# Altium schematic sheet 2_02 Peripherals.SchDoc.schdoc
size 858 x 289 mm; Name: A_Customize; Symbol: A_Customize; Device: A_Customize; @Project Name: 02 Peripherals.SchDoc; REV: 1.0; Date: 2024-05-14; Sheet: 1/1; Draw By: TheConquerK; Company: NEU-REAL-LAB; Convert to PCB: yes; Add into BOM: yes
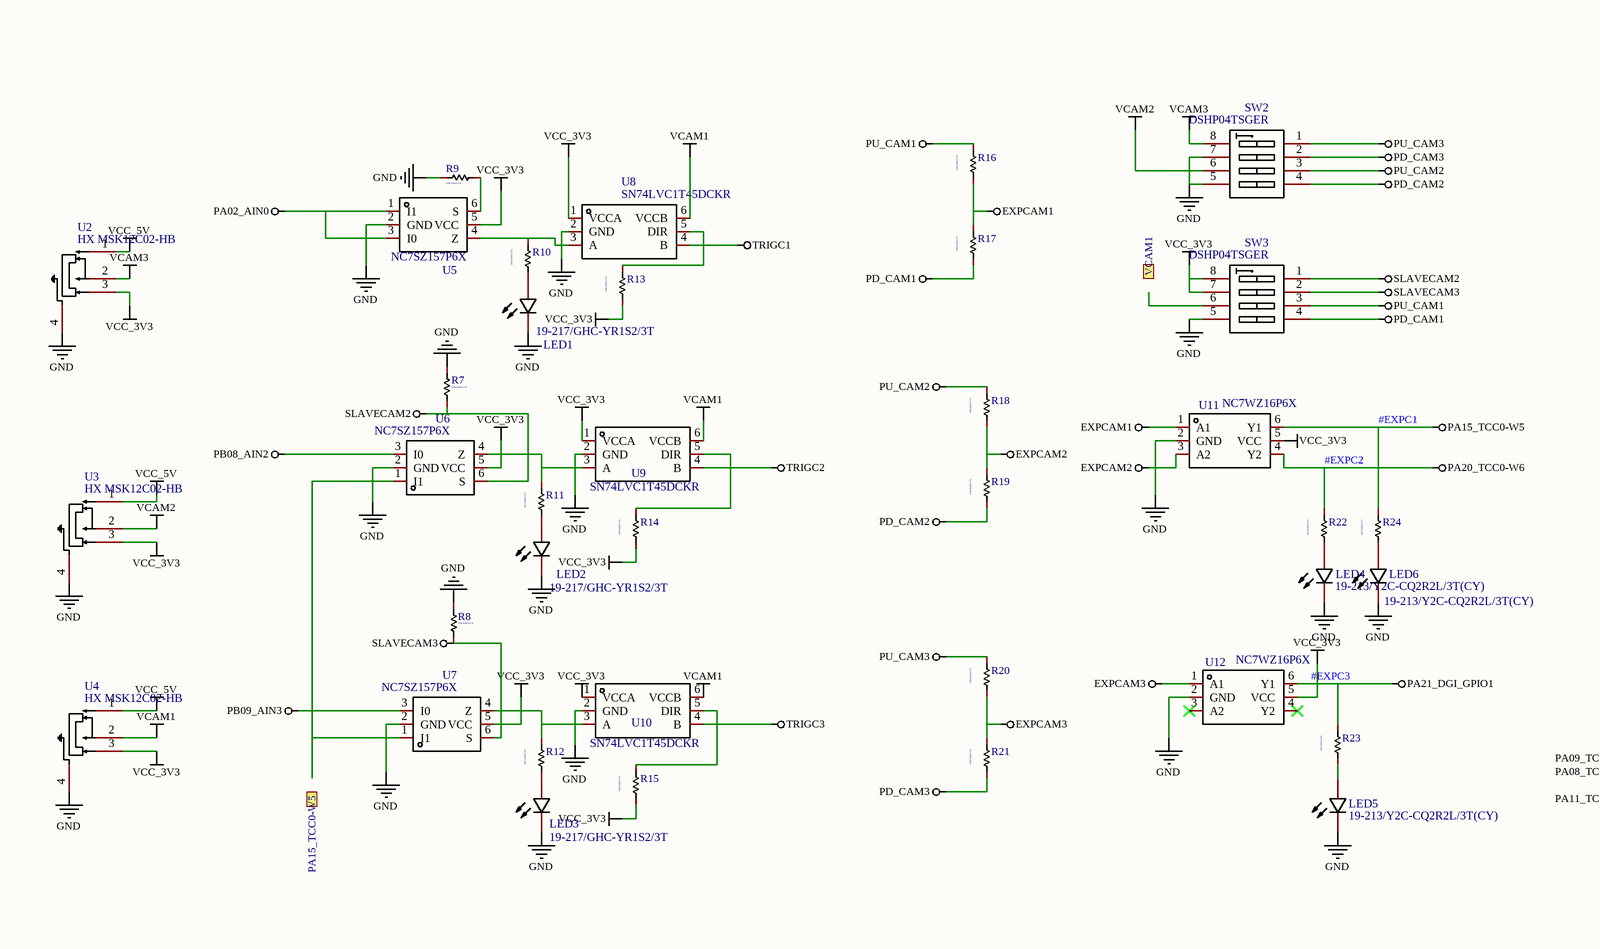
[diagram p0: 2_02 Peripherals.SchDoc.schdoc, left]
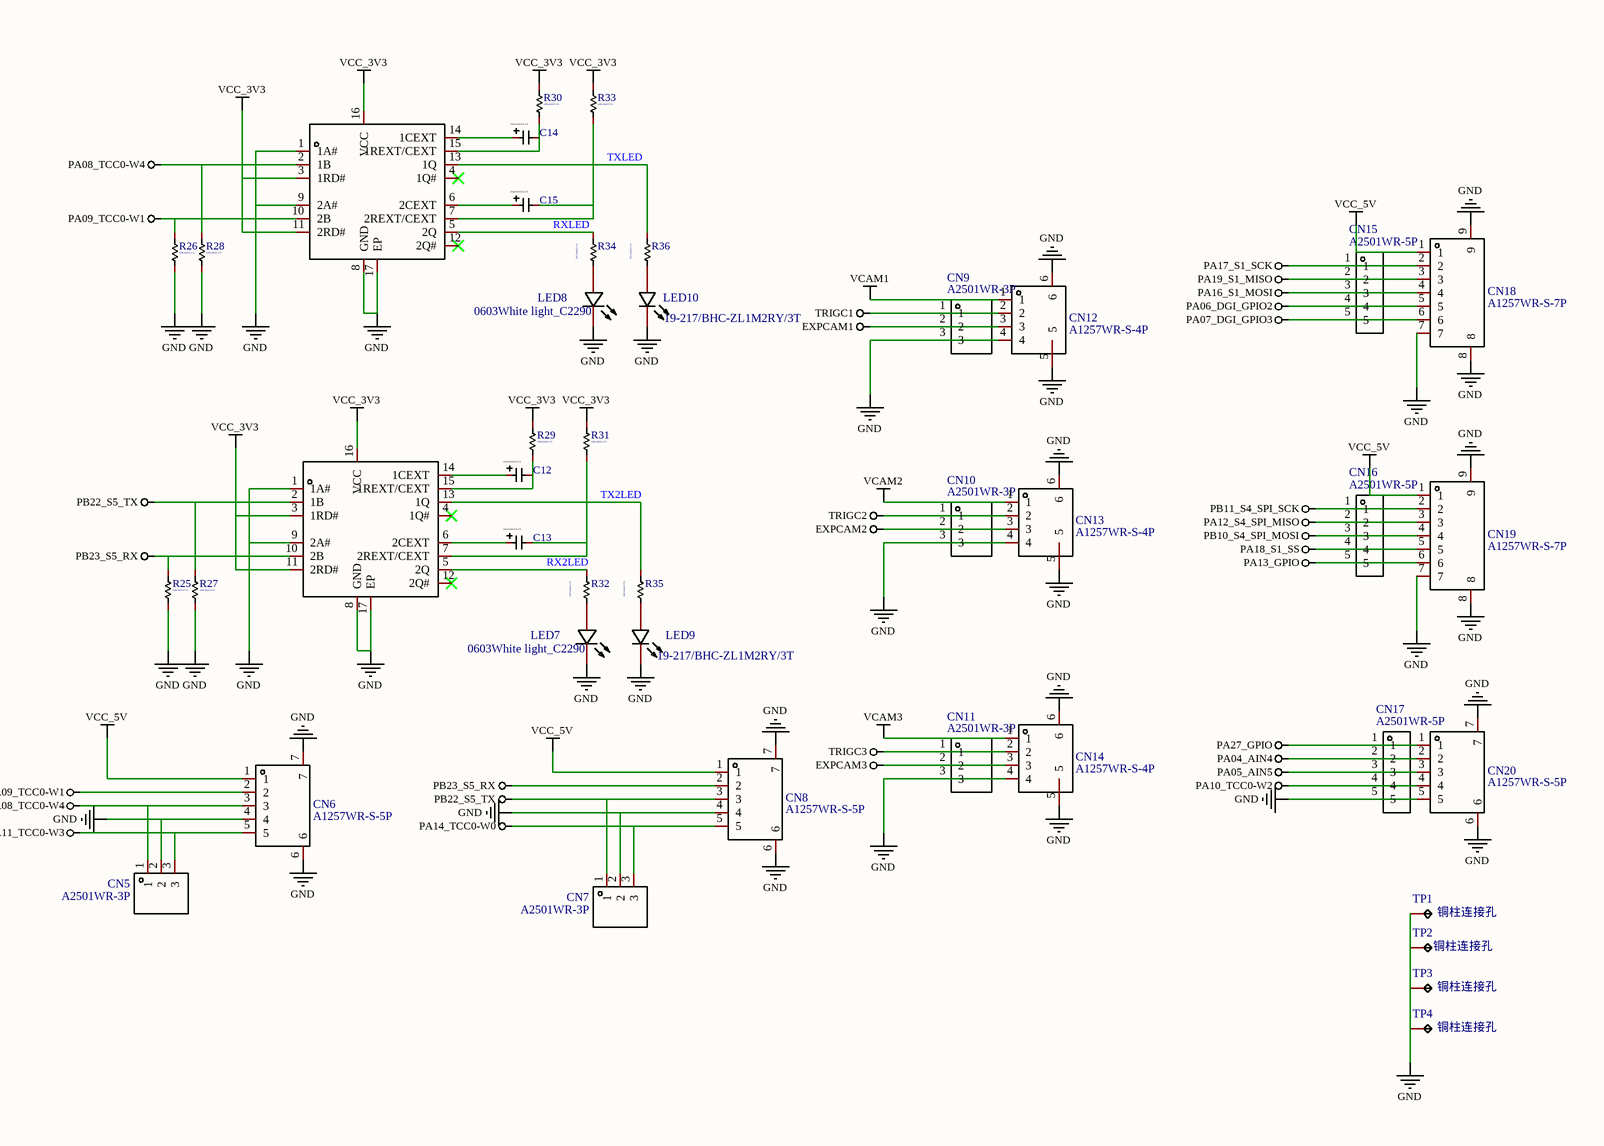
[diagram p1: 2_02 Peripherals.SchDoc.schdoc, right]

## Parts
C12  2.2u  [C0603]  (value not drawn)
C13  2.2u  [C0603]  (value not drawn)
C14  2.2u  [C0603]  (value not drawn)
C15  2.2u  [C0603]  (value not drawn)
CN5  A2501WR-3P  [CONN-TH_A2501WR-3P]
CN6  A1257WR-S-5P  [CONN-SMD_A1257WR-S-5P]
CN7  A2501WR-3P  [CONN-TH_A2501WR-3P]
CN8  A1257WR-S-5P  [CONN-SMD_A1257WR-S-5P]
CN9  A2501WR-3P  [CONN-TH_A2501WR-3P]
CN10  A2501WR-3P  [CONN-TH_A2501WR-3P]
CN11  A2501WR-3P  [CONN-TH_A2501WR-3P]
CN12  A1257WR-S-4P  [CONN-SMD_A1257WR-S-4P]
CN13  A1257WR-S-4P  [CONN-SMD_A1257WR-S-4P]
CN14  A1257WR-S-4P  [CONN-SMD_A1257WR-S-4P]
CN15  A2501WR-5P  [CONN-TH_A2501WR-5P]
CN16  A2501WR-5P  [CONN-TH_A2501WR-5P]
CN17  A2501WR-5P  [CONN-TH_A2501WR-5P]
CN18  A1257WR-S-7P  [CONN-SMD_A1257WR-S-7P]
CN19  A1257WR-S-7P  [CONN-SMD_A1257WR-S-7P]
CN20  A1257WR-S-5P  [CONN-SMD_A1257WR-S-5P]
LED1  19-217/GHC-YR1S2/3T  [LED0603-RD]
LED2  19-217/GHC-YR1S2/3T  [LED0603-RD]
LED3  19-217/GHC-YR1S2/3T  [LED0603-RD]
LED4  19-213/Y2C-CQ2R2L/3T(CY)  [LED0603-RD-YELLOW]
LED5  19-213/Y2C-CQ2R2L/3T(CY)  [LED0603-RD-YELLOW]
LED6  19-213/Y2C-CQ2R2L/3T(CY)  [LED0603-RD-YELLOW]
LED7  0603White light_C2290  [LED0603-R-RD_WHITE]
LED8  0603White light_C2290  [LED0603-R-RD_WHITE]
LED9  19-217/BHC-ZL1M2RY/3T  [LED0603-FD_BLUE]
LED10  19-217/BHC-ZL1M2RY/3T  [LED0603-FD_BLUE]
R7  10K/0402/1%  [R0402]
R8  10K/0402/1%  [R0402]
R9  10K/0402/1%  [R0402]
R10  2K2/0402/1%  [R0402]
R11  2K2/0402/1%  [R0402]
R12  2K2/0402/1%  [R0402]
R13  10K/0402/1%  [R0402]
R14  10K/0402/1%  [R0402]
R15  10K/0402/1%  [R0402]
R16  10K/0402/1%  [R0402]
R17  10K/0402/1%  [R0402]
R18  10K/0402/1%  [R0402]
R19  10K/0402/1%  [R0402]
R20  10K/0402/1%  [R0402]
R21  10K/0402/1%  [R0402]
R22  2K2/0402/1%  [R0402]
R23  2K2/0402/1%  [R0402]
R24  2K2/0402/1%  [R0402]
R25  10K/0402/1%  [R0402]
R26  10K/0402/1%  [R0402]
R27  10K/0402/1%  [R0402]
R28  10K/0402/1%  [R0402]
R29  10K/0402/1%  [R0402]
R30  10K/0402/1%  [R0402]
R31  10K/0402/1%  [R0402]
R32  2K2/0402/1%  [R0402]
R33  10K/0402/1%  [R0402]
R34  2K2/0402/1%  [R0402]
R35  2K2/0402/1%  [R0402]
R36  2K2/0402/1%  [R0402]
SW2  DSHP04TSGER  [SW-SMD_8P-L6.7-W5.4-P1.27-LS8.4]
SW3  DSHP04TSGER  [SW-SMD_8P-L6.7-W5.4-P1.27-LS8.4]
TP1  铜柱连接孔  [3MM铜柱孔]
TP2  铜柱连接孔  [3MM铜柱孔]
TP3  铜柱连接孔  [3MM铜柱孔]
TP4  铜柱连接孔  [3MM铜柱孔]
U2  HX MSK12C02-HB  [SW-SMD_MSK12C02-HB]
U3  HX MSK12C02-HB  [SW-SMD_MSK12C02-HB]
U4  HX MSK12C02-HB  [SW-SMD_MSK12C02-HB]
U5  NC7SZ157P6X  [SC-70-6_L2.0-W1.3-P0.65-LS2.1-BR]
U6  NC7SZ157P6X  [SC-70-6_L2.0-W1.3-P0.65-LS2.1-BR]
U7  NC7SZ157P6X  [SC-70-6_L2.0-W1.3-P0.65-LS2.1-BR]
U8  SN74LVC1T45DCKR  [SC-70-6_L2.2-W1.3-P0.65-LS2.2-BR]
U9  SN74LVC1T45DCKR  [SC-70-6_L2.2-W1.3-P0.65-LS2.2-BR]
U10  SN74LVC1T45DCKR  [SC-70-6_L2.2-W1.3-P0.65-LS2.2-BR]
U11  NC7WZ16P6X  [SC-70-6_L2.2-W1.3-P0.65-LS2.1-BR]
U12  NC7WZ16P6X  [SC-70-6_L2.2-W1.3-P0.65-LS2.1-BR]
U13  74AHC123ABQ,115  [74AHC123ABQ,115]  (value not drawn)
U14  74AHC123ABQ,115  [74AHC123ABQ,115]  (value not drawn)

## Ports
PA15_TCC0-W5 (out), VCAM1 (out)

## Nets
#EXPC1: R24.2 U11.6(Y1)  [also labelled PA15_TCC0-W5]
#EXPC2: R22.2 U11.4(Y2)  [also labelled PA20_TCC0-W6]
#EXPC3: R23.2 U12.6(Y1)  [also labelled PA21_DGI_GPIO1]
EXPCAM1: CN9.2 CN12.3 R16.1 R17.2 U11.1(A1)
EXPCAM2: CN10.2 CN13.3 R18.1 R19.2 U11.3(A2)
EXPCAM3: CN11.2 CN14.3 R20.1 R21.2 U12.1(A1)
GND: CN5.2 CN6.4 CN6.6 CN6.7 CN7.2 CN8.4 CN8.6 CN8.7 CN9.3 CN10.3 CN11.3 CN12.4 CN12.5 CN12.6 CN13.4 CN13.5 CN13.6 CN14.4 CN14.5 CN14.6 CN17.5 CN18.7 CN18.8 CN18.9 CN19.7 CN19.8 CN19.9 CN20.5 CN20.6 CN20.7 LED1.1(C) LED2.1(C) LED3.1(C) LED4.1(C) LED5.1(C) LED6.1(C) LED7.2(K) LED8.2(K) LED9.1(C) LED10.1(C) R7.2 R8.2 R9.2 R25.1 R26.1 R27.1 R28.1 SW2.5(B4) SW2.7(B2) SW3.5(B4) TP1.1 TP2.1 TP3.1 TP4.1 U2.4 U3.4 U4.4 U5.2(GND) U6.2(GND) U7.2(GND) U8.2(GND) U9.2(GND) U10.2(GND) U11.2(GND) U12.2(GND) U13.1(1A#) U13.8(GND) U13.9(2A#) U13.17(EP) U14.1(1A#) U14.8(GND) U14.9(2A#) U14.17(EP)
PA02_AIN0: U5.1(I1) U5.3(I0)
PA04_AIN4: CN17.2 CN20.2
PA05_AIN5: CN17.3 CN20.3
PA06_DGI_GPIO2: CN15.4 CN18.5
PA07_DGI_GPIO3: CN15.5 CN18.6
PA08_TCC0-W4: CN5.1 CN6.3 R28.2 U14.2(1B)
PA09_TCC0-W1: CN6.2 R26.2 U14.10(2B)
PA10_TCC0-W2: CN17.4 CN20.4
PA11_TCC0-W3: CN5.3 CN6.5
PA12_S4_SPI_MISO: CN16.2 CN19.3
PA13_GPIO: CN16.5 CN19.6
PA14_TCC0-W0: CN7.3 CN8.5
PA16_S1_MOSI: CN15.3 CN18.4
PA17_S1_SCK: CN15.1 CN18.2
PA18_S1_SS: CN16.4 CN19.5
PA19_S1_MISO: CN15.2 CN18.3
PA27_GPIO: CN17.1 CN20.1
PB08_AIN2: U6.3(I0)
PB09_AIN3: U7.3(I0)
PB10_S4_SPI_MOSI: CN16.3 CN19.4
PB11_S4_SPI_SCK: CN16.1 CN19.2
PB22_S5_TX: CN7.1 CN8.3 R27.2 U13.2(1B)
PB23_S5_RX: CN8.2 R25.2 U13.10(2B)
PD_CAM1: R17.1 SW3.4(A4)
PD_CAM2: R19.1 SW2.4(A4)
PD_CAM3: R21.1 SW2.2(A2)
PU_CAM1: R16.2 SW3.3(A3)
PU_CAM2: R18.2 SW2.3(A3)
PU_CAM3: R20.2 SW2.1(A1)
SLAVECAM2: R7.1 SW3.1(A1) U6.6(S)
SLAVECAM3: R8.1 SW3.2(A2) U7.6(S)
TRIGC1: CN9.1 CN12.2 U8.4(B)
TRIGC2: CN10.1 CN13.2 U9.4(B)
TRIGC3: CN11.1 CN14.2 U10.4(B)
VCAM1: CN12.1 U4.2 U8.6(VCCB) U9.6(VCCB) U10.6(VCCB)
VCAM2: CN13.1 SW2.6(B3) U3.2
VCAM3: CN14.1 SW2.8(B1) U2.2
VCC_3V3: R13.1 R14.1 R15.1 R29.2 R30.2 R31.2 R33.2 SW3.7(B2) SW3.8(B1) U2.3 U3.3 U4.3 U5.5(VCC) U6.5(VCC) U7.5(VCC) U8.1(VCCA) U9.1(VCCA) U10.1(VCCA) U11.5(VCC) U12.5(VCC) U13.3(1RD#) U13.11(2RD#) U13.16(VCC) U14.3(1RD#) U14.11(2RD#) U14.16(VCC)
VCC_5V: CN6.1 CN8.1 CN18.1 CN19.1 U2.1 U3.1 U4.1
RX2LED: R32.2 U13.5(2Q)
RXLED: R34.2 U14.5(2Q)
TX2LED: R35.2 U13.13(1Q)
TXLED: R36.2 U14.13(1Q)
NetC12_1: C12.1 U13.14(1CEXT)
NetC12_2: C12.2 R29.1 U13.15(1REXT/CEXT)
NetC13_1: C13.1 U13.6(2CEXT)
NetC13_2: C13.2 R31.1 U13.7(2REXT/CEXT)
NetC14_1: C14.1 U14.14(1CEXT)
NetC14_2: C14.2 R30.1 U14.15(1REXT/CEXT)
NetC15_1: C15.1 U14.6(2CEXT)
NetC15_2: C15.2 R33.1 U14.7(2REXT/CEXT)
NetLED1_2: LED1.2(A) R10.1
NetLED2_2: LED2.2(A) R11.1
NetLED3_2: LED3.2(A) R12.1
NetLED4_2: LED4.2(A) R22.1
NetLED5_2: LED5.2(A) R23.1
NetLED6_2: LED6.2(A) R24.1
NetLED7_1: LED7.1(A) R32.1
NetLED8_1: LED8.1(A) R34.1
NetLED9_2: LED9.2(A) R35.1
NetLED10_2: LED10.2(A) R36.1
NetR9_1: R9.1 U5.6(S)
NetR10_2: R10.2 U5.4(Z) U8.3(A)
NetR11_2: R11.2 U6.4(Z) U9.3(A)
NetR12_2: R12.2 U7.4(Z) U10.3(A)
NetR13_2: R13.2 U8.5(DIR)
NetR14_2: R14.2 U9.5(DIR)
NetR15_2: R15.2 U10.5(DIR)
NetU6_1: U6.1(I1) U7.1(I1)

Not connected (* = marked no-connect by the designer): SW3 6(B3); U12 3(A2)* 4(Y2)*; U13 4(1Q#)* 12(2Q#)*; U14 4(1Q#)* 12(2Q#)*

## Notes on the sheet
- 1
- 2
- 3
- 4
- 5
- 6
- 7
- 8
- 9
- 10
- 11
- 12
- A
- B
- C
- D
- TITLE:
- 02 Peripherals.SchDoc
- REV:
- 1.0
- Date:
- Company:
- 2024-05-14
- NEU-REAL-LAB
- Drawn By:
- TheConquerK
- Sheet:
- 1/1
- (in symbol 2.2u) 10uF/0603/6.3V

## Library data of the parts
C12-C15 = 2.2u: Convert to PCB: yes; Name: 2.2u; Symbol: 2.2u; Device: 2.2u; Add into BOM: yes; Origin Footprint: C0603
CN5 CN7 CN9-CN11 = A2501WR-3P: Manufacturer: CJT(长江连接器); Convert to PCB: yes; Name: A2501WR-3P; Symbol: A2501WR-3P; Device: A2501WR-3P; Supplier: LCSC; Supplier Part: C225400; Manufacturer Part: A2501WR-3P; JLCPCB Part Class: Extended Part; Add into BOM: yes; Origin Footprint: CONN-TH_A2501WR-3P
CN6 CN8 CN20 = A1257WR-S-5P: Manufacturer: CJT(长江连接器); Convert to PCB: yes; Name: A1257WR-S-5P; Symbol: A1257WR-S-5P; Device: A1257WR-S-5P; Supplier: LCSC; Supplier Part: C225128; Manufacturer Part: A1257WR-S-5P; JLCPCB Part Class: Extended Part; Add into BOM: yes; Origin Footprint: CONN-SMD_A1257WR-S-5P
CN12-CN14 = A1257WR-S-4P: Manufacturer: CJT(长江连接器); Convert to PCB: yes; Name: A1257WR-S-4P; Symbol: A1257WR-S-4P; Device: A1257WR-S-4P; Supplier: LCSC; Supplier Part: C225127; Manufacturer Part: A1257WR-S-4P; JLCPCB Part Class: Extended Part; Add into BOM: yes; Origin Footprint: CONN-SMD_A1257WR-S-4P
CN15-CN17 = A2501WR-5P: Manufacturer: CJT(长江连接器); Convert to PCB: yes; Name: A2501WR-5P; Symbol: A2501WR-5P; Device: A2501WR-5P; Supplier: LCSC; Supplier Part: C225402; Manufacturer Part: A2501WR-5P; JLCPCB Part Class: Extended Part; Add into BOM: yes; Origin Footprint: CONN-TH_A2501WR-5P
CN18 CN19 = A1257WR-S-7P: Manufacturer: CJT(长江连接器); Convert to PCB: yes; Name: A1257WR-S-7P; Symbol: A1257WR-S-7P; Device: A1257WR-S-7P; Supplier: LCSC; Supplier Part: C225130; Manufacturer Part: A1257WR-S-7P; JLCPCB Part Class: Extended Part; Add into BOM: yes; Origin Footprint: CONN-SMD_A1257WR-S-7P
LED1-LED3 = 19-217/GHC-YR1S2/3T: Manufacturer: EVERLIGHT(亿光); Convert to PCB: yes; Name: 19-217/GHC-YR1S2/3T; Symbol: 19-217/GHC-YR1S2/3T; Device: 19-217/GHC-YR1S2/3T; Supplier: LCSC; Manufacturer Part: 19-217/GHC-YR1S2/3T; Supplier Part: C72043; JLCPCB Part Class: Basic Part; Add into BOM: yes; Origin Footprint: LED0603-RD
LED4-LED6 = 19-213/Y2C-CQ2R2L/3T(CY): Manufacturer: EVERLIGHT(亿光); Convert to PCB: yes; Name: 19-213/Y2C-CQ2R2L/3T(CY); Symbol: 19-213/Y2C-CQ2R2L/3T(CY); Device: 19-213/Y2C-CQ2R2L/3T(CY); Supplier: LCSC; Manufacturer Part: 19-213/Y2C-CQ2R2L/3T(CY); Supplier Part: C72038; JLCPCB Part Class: Basic Part; Add into BOM: yes; Origin Footprint: LED0603-RD-YELLOW
LED7 LED8 = 0603White light_C2290: Manufacturer: KENTO; Manufacturer Part: KT-0603白灯; Convert to PCB: yes; Name: 0603White light_C2290; Symbol: 0603White light_C2290; Device: 0603White light_C2290; Supplier: LCSC; Supplier Part: C2290; JLCPCB Part Class: Basic Part; Add into BOM: yes; Origin Footprint: LED0603-R-RD_WHITE
LED9 LED10 = 19-217/BHC-ZL1M2RY/3T: Manufacturer: EVERLIGHT(亿光); Convert to PCB: yes; Name: 19-217/BHC-ZL1M2RY/3T; Symbol: 19-217/BHC-ZL1M2RY/3T; Device: 19-217/BHC-ZL1M2RY/3T; Supplier: LCSC; Manufacturer Part: 19-217/BHC-ZL1M2RY/3T; Supplier Part: C72041; JLCPCB Part Class: Basic Part; Add into BOM: yes; Origin Footprint: LED0603-FD_BLUE
R7-R9 R13-R21 R25-R31 R33 = 10K/0402/1%: Convert to PCB: yes; Name: 10K/0402/1%; Symbol: 10K/0402/1%; Device: 10K/0402/1%; Published: 8-Jun-2000; LatestRevisionDate: 17-Jul-2002; LatestRevisionNote: Re-released for DXP Platform.; PackageReference: AXIAL-0.5; Publisher: Altium Limited; PackageDescription: Axial Device, Thru-Hole; 2 Leads; 0.5 in Pin Spacing; Add into BOM: yes; Origin Footprint: R0402
R10-R12 R22-R24 R32 R34-R36 = 2K2/0402/1%: Convert to PCB: yes; Name: 2K2/0402/1%; Symbol: 2K2/0402/1%; Device: 2K2/0402/1%; Published: 8-Jun-2000; LatestRevisionDate: 17-Jul-2002; LatestRevisionNote: Re-released for DXP Platform.; PackageReference: AXIAL-0.5; Publisher: Altium Limited; PackageDescription: Axial Device, Thru-Hole; 2 Leads; 0.5 in Pin Spacing; Add into BOM: yes; Origin Footprint: R0402
SW2 SW3 = DSHP04TSGER: Manufacturer: YE; Manufacturer Part: DSHP04TSGET; Convert to PCB: yes; Name: DSHP04TSGER; Symbol: DSHP04TSGER; Device: DSHP04TSGER; Supplier: LCSC; Supplier Part: C40736; JLCPCB Part Class: Extended Part; Add into BOM: yes; Origin Footprint: SW-SMD_8P-L6.7-W5.4-P1.27-LS8.4
TP1-TP4 = 铜柱连接孔: Manufacturer: Keystone; Manufacturer Part: 6037; Convert to PCB: yes; Name: 铜柱连接孔; Symbol: 铜柱连接孔; Device: 铜柱连接孔; Supplier: LCSC; Supplier Part: C238145; Add into BOM: yes; Origin Footprint: 3MM铜柱孔
U2-U4 = HX MSK12C02-HB: Manufacturer: hanxia(韩下); Convert to PCB: yes; Name: HX MSK12C02-HB; Symbol: HX MSK12C02-HB; Device: HX MSK12C02-HB; Supplier: LCSC; Supplier Part: C5149817; Manufacturer Part: HX MSK12C02-HB; link: https://atta.szlcsc.com/upload/public/pdf/source/20220907/9FFF0EFCC2FB5829D7D0DE0DF6E27CCE.pdf; JLCPCB Part Class: Extended Part; Add into BOM: yes; Origin Footprint: SW-SMD_MSK12C02-HB
U5-U7 = NC7SZ157P6X: Manufacturer: onsemi(安森美); Convert to PCB: yes; Name: NC7SZ157P6X; Symbol: NC7SZ157P6X; Device: NC7SZ157P6X; Supplier: LCSC; Supplier Part: C77686; Manufacturer Part: NC7SZ157P6X; JLCPCB Part Class: Extended Part; Add into BOM: yes; Origin Footprint: SC-70-6_L2.0-W1.3-P0.65-LS2.1-BR
U8-U10 = SN74LVC1T45DCKR: Manufacturer: TI(德州仪器); Convert to PCB: yes; Name: SN74LVC1T45DCKR; Symbol: SN74LVC1T45DCKR; Device: SN74LVC1T45DCKR; Supplier: LCSC; Manufacturer Part: SN74LVC1T45DCKR; Supplier Part: C9382; JLCPCB Part Class: Extended Part; Add into BOM: yes; Origin Footprint: SC-70-6_L2.2-W1.3-P0.65-LS2.2-BR
U11 U12 = NC7WZ16P6X: Manufacturer: onsemi(安森美); Convert to PCB: yes; Name: NC7WZ16P6X; Symbol: NC7WZ16P6X; Device: NC7WZ16P6X; Supplier: LCSC; Supplier Part: C114148; Manufacturer Part: NC7WZ16P6X; JLCPCB Part Class: Extended Part; Add into BOM: yes; Origin Footprint: SC-70-6_L2.2-W1.3-P0.65-LS2.1-BR
U13 U14 = 74AHC123ABQ,115: Manufacturer: Nexperia(安世); Add into BOM: yes; Logic Family: 74AHC; Logic Gate Type: 单稳态; Number Of Channels: 2; Schmidt trigger input: 否; propagation delay: 5.1ns; Current-OutputLow: 8mA; Supply Voltage: 2V5.5V; Origin Footprint: DHVQFN-16_L3.5-W2.5-P0.50-BL-EP; Name: 74AHC123ABQ,115; Symbol: 74AHC123ABQ,115; Device: 74AHC123ABQ,115; LCSC Part Name: 74AHC123ABQ,115; Supplier Part: C554211; Manufacturer Part: 74AHC123ABQ,115; Supplier Footprint: DHVQFN-16; JLCPCB Part Class: Extended Part; Datasheet: https://atta.szlcsc.com/upload/public/pdf/source/20171113/C87362_15105616511311116138.pdf; Supplier: LCSC; Convert to PCB: yes; Current-OutputHigh: 8mA; OperatingTemperature: -40℃+125℃